# EAGLE design evpr_programmer (EAGLE 9.5.2)
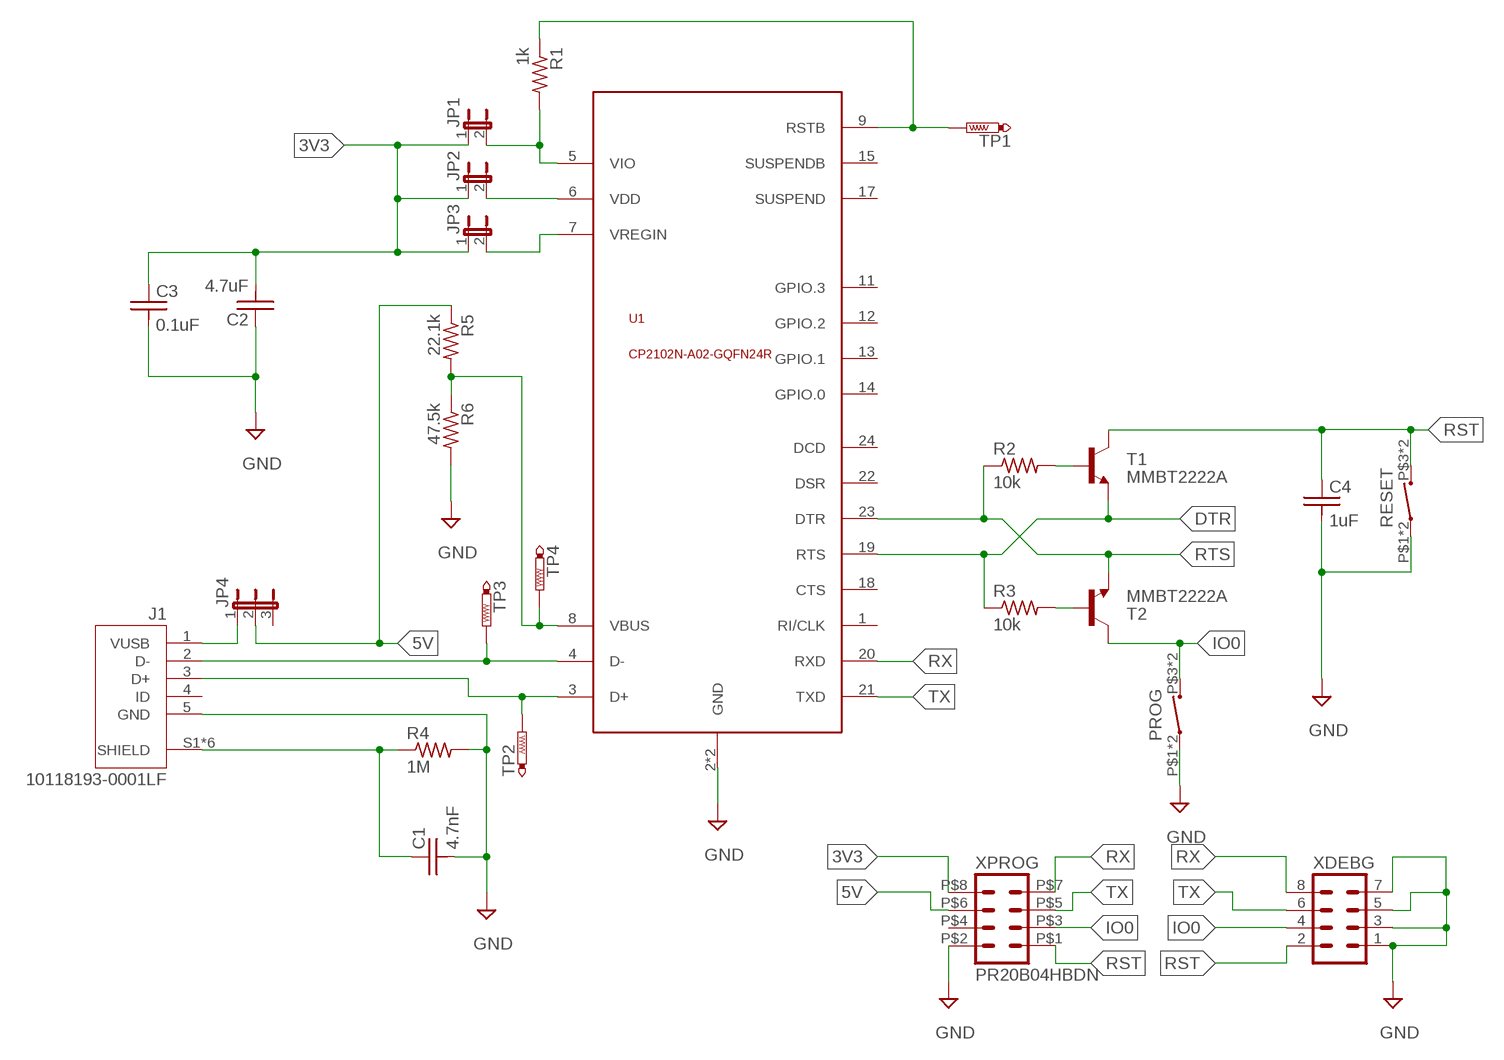
[diagram p0: schematic, sheet 1]

## Parts
C1  4.7nF  C0603  [C0603]
C2  4.7uF  C0603  [C0603]
C3  0.1uF  C0603  [C0603]
C4  1uF  C0603  [C0603]
J1  10118193-0001LF  [FCI_10118193-0001LF]
JP1  JP1E  [JP1]
JP2  JP1E  [JP1]
JP3  JP1E  [JP1]
JP4  JP2E  [JP2]
PROG  MOMENTARY_SWITCH  [PTS645]
R1  1k  R0603  [R0603]
R2  10k  R0603  [R0603]
R3  10k  R0603  [R0603]
R4  1M  R0603  [R0603]
R5  22.1k  R0603  [R0603]
R6  47.5k  R0603  [R0603]
RESET  MOMENTARY_SWITCH  [PTS645]
T1  MMBT2222A  MMBT2222ALT1-NPN-SOT23-BEC  [SOT23-BEC]
T2  MMBT2222A  MMBT2222ALT1-NPN-SOT23-BEC  [SOT23-BEC]
TP1  PTR1TP10R  [TP10R]
TP2  PTR1TP10R  [TP10R]
TP3  PTR1TP10R  [TP10R]
TP4  PTR1TP10R  [TP10R]
U1  CP2102N-A02-GQFN24R  [QFN24-4X4]
XDEBG  MA04-2  [MA04-2]
XPROG  PR20B04HBDN  [PR20B04HBDN]

## Nets
3V3: C2.2 C3.1 JP1.1 JP2.1 JP3.1 XPROG.P$8
5V: JP4.2 R5.1 XPROG.P$6
DTR: R3.1 T1.E U1.19(RTS)
GND: C1.2 C2.1 C3.2 C4.2 J1.5(GND) PROG.P$1 PROG.P$2 R4.2 R6.2 RESET.P$1 RESET.P$2 U1.2(GND) U1.EXP(GND) XDEBG.1 XDEBG.3 XDEBG.5 XDEBG.7 XPROG.P$2
IO0: PROG.P$3 PROG.P$4 T2.C XDEBG.4 XPROG.P$3
N$1: J1.1(VUSB) JP4.1
N$2: JP2.2 U1.6(VDD)
N$3: R1.1 TP1.TP U1.9(RSTB)
N$4: JP1.2 R1.2 U1.5(VIO)
N$5: C1.1 J1.S1(SHIELD) J1.S2(SHIELD) J1.S3(SHIELD) J1.S4(SHIELD) J1.S5(SHIELD) J1.S6(SHIELD) R4.1
N$7: R3.2 T2.B
N$8: R2.2 T1.B
N$11: J1.3(D+) TP2.TP U1.3(D+)
N$12: J1.2(D-) TP3.TP U1.4(D-)
N$13: JP3.2 U1.7(VREGIN)
N$14: R5.2 R6.1 TP4.TP U1.8(VBUS)
RST: C4.1 RESET.P$3 RESET.P$4 T1.C XDEBG.2 XPROG.P$1
RTS: R2.1 T2.E U1.23(DTR)
RX: U1.20(RXD) XDEBG.8 XPROG.P$7
TX: U1.21(TXD) XDEBG.6 XPROG.P$5
Unconnected: J1.4(ID) JP4.3 U1.1(RI/CLK) U1.11(GPIO.3) U1.12(GPIO.2) U1.13(GPIO.1) U1.14(GPIO.0) U1.15(SUSPENDB) U1.17(SUSPEND) U1.18(CTS) U1.22(DSR) U1.24(DCD) XPROG.P$4

## Library data of the parts
C1 = mccloud:C0603: CAPACITOR, American symbol; COMPONENT: CC0603CRNPO9BN4R7
C2 = mccloud:C0603: CAPACITOR, American symbol; COMPONENT: CL10A475MQ8NNNC
C3 = mccloud:C0603: CAPACITOR, American symbol; COMPONENT: 06033C104JAT2A
C4 = mccloud:C0603: CAPACITOR, American symbol
J1 = mccloud:10118193-0001LF: Micro USB B Type Receptacle; DESCRIPTION: Single Port 5 Contact Shielded SMT MICRO USB B-Type Receptacle; DIGI-KEY_PART_NUMBER: 609-4616-1-ND; DIGI-KEY_PURCHASE_URL: https://www.digikey.com/product-detail/en/amphenol-icc-fci/10118193-0001LF/609-4616-1-ND/2785380?utm_source=snapeda&utm_medium=aggregator&utm_campaign=symbol; MF: Amphenol ICC; MP: 10118193-0001LF; PACKAGE: None
JP1-JP3 = jumper:JP1E: JUMPER
JP4 = jumper:JP2E: JUMPER
PROG = mccloud:MOMENTARY_SWITCH
R1 = mccloud:R0603: RESISTOR, American symbol; COMPONENT: RMCF0603FT1K00; SPICEPREFIX: R
R2 R3 = mccloud:R0603: RESISTOR, American symbol; COMPONENT: RMCF0603FT10K0; SPICEPREFIX: R
R4 = mccloud:R0603: RESISTOR, American symbol; SPICEPREFIX: R
R5 = mccloud:R0603: RESISTOR, American symbol; COMPONENT: RMCF0603FT22K1; SPICEPREFIX: R
R6 = mccloud:R0603: RESISTOR, American symbol; COMPONENT: RMCF0603FT47K5; SPICEPREFIX: R
RESET = mccloud:MOMENTARY_SWITCH; COMPONENT: PTS645
T1 T2 = transistor-neu-to92:*-NPN-: NPN Transistror
TP1-TP4 = testpad:PTR1: TEST PIN
U1 = mccloud:CP2102N-A02-GQFN24R
XDEBG = con-lstb:MA04-2: PIN HEADER; OC_FARNELL: unknown; OC_NEWARK: unknown
XPROG = mccloud:PR20B04HBDN

## Board
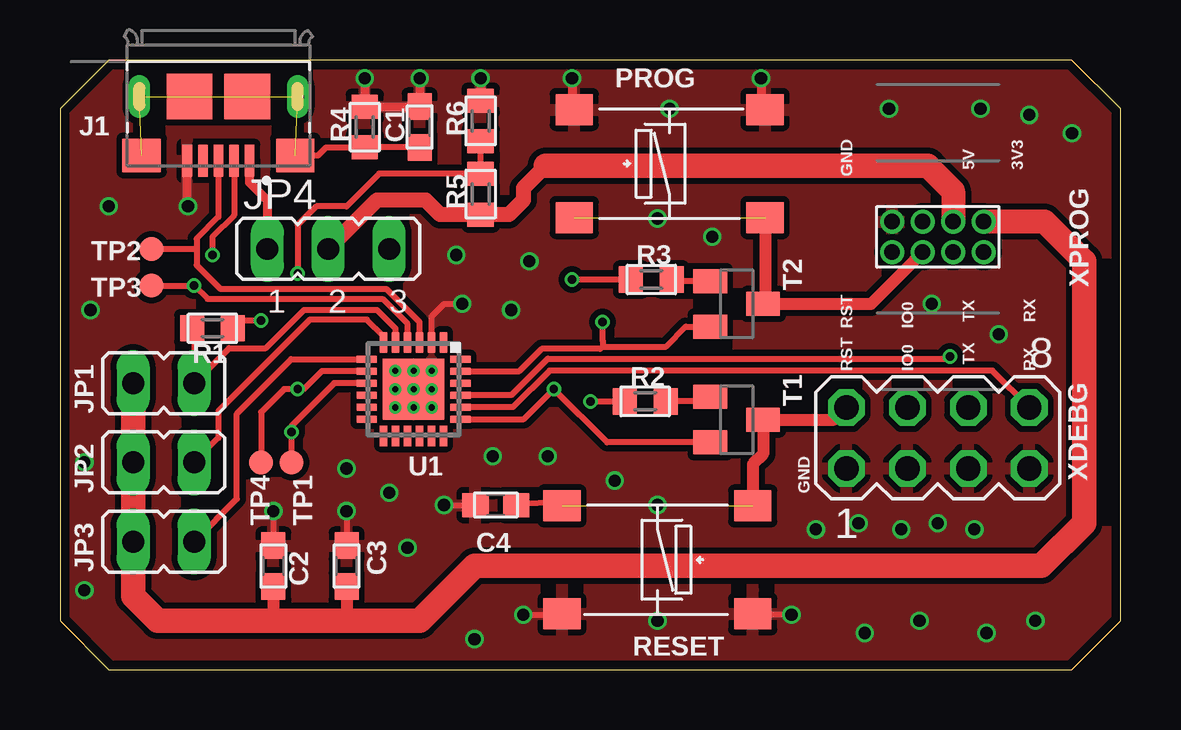
[diagram p1: board, top side]
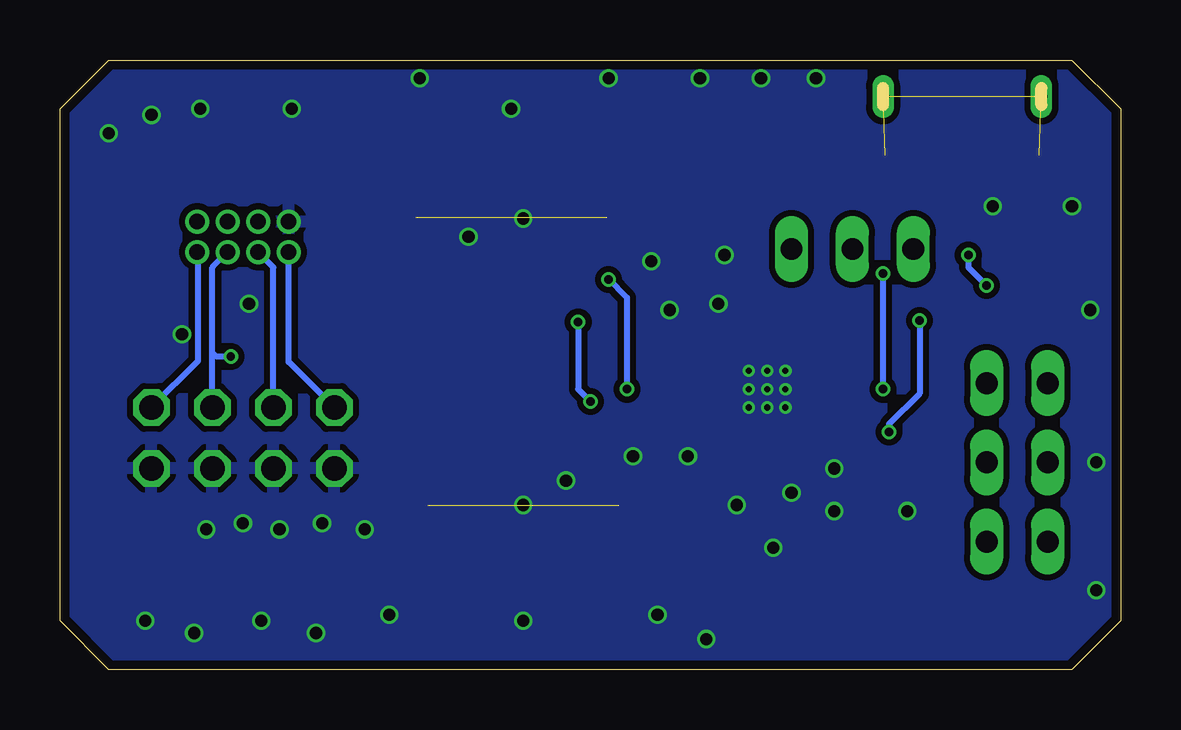
[diagram p2: board, bottom side, seen from below]

Size 44.2 x 25.4 mm. Coordinates in mm from the lower left corner, seen from the top.
Outline: 2.03,0 42.16,0 44.2,2.03 44.2,23.37 42.16,25.4 2.03,25.4 0,23.37 0,2.03 2.03,0
Copper layers (1*16): Top 0.035559375mm / dielectric 1.6mm / Bottom 0.035559375mm
Design rules "oshpark-2layer": minimum track width 6mil, minimum drill 10mil, track to track 6mil, track to pad 6mil, pad to pad 6mil, via to via 6mil, smd to smd 6mil, copper to edge 15mil, drill to drill 6mil, minimum pad ring 5mil, minimum via ring 5mil, stop-mask expansion 2.5mil, vias tented up to drill 0mil, thermal gap 10mil

### Footprints (pad centres in the part's own frame; a part is rotated, then mirrored left to right if it is on the bottom)
C0603 = smd 1.1 x 1: 1 -0.85,0; 2 0.85,0
FCI_10118193-0001LF = smd 0.4 x 1.35: 1 -1.3,2.675; 2 -0.65,2.675; 3 0,2.675; 4 0.65,2.675; 5 1.3,2.675 | smd 1.6 x 1.4: S1 -3.2,2.45; S2 3.2,2.45 | smd 1.9 x 1.9: S3 1.2,0; S4 -1.2,0 | drill 0.5 pad 0.9 long: S5 -3.3,0; S6 3.3,0
JP1 = drill 0.914 long: 1 0,-1.27; 2 0,1.27
JP2 = drill 0.914 long: 1 -2.54,0; 2 0,0; 3 2.54,0
PTS645 = smd 1.55 x 1.3: P$1 -3.975,2.25; P$2 3.975,2.25; P$3 -3.975,-2.25; P$4 3.975,-2.25
R0603 = smd 1 x 1.1: 1 -0.85,0; 2 0.85,0
SOT23-BEC = smd 1 x 1.4: B -0.95,-1.1; C 0,1.1; E 0.95,-1.1
TP10R = smd 1 x 1: TP 0,0
QFN24-4X4 = smd 0.85 x 0.3: 1 -1.95,1.25; 2 -1.95,0.75; 3 -1.95,0.25; 4 -1.95,-0.25; 5 -1.95,-0.75; 6 -1.95,-1.25; 13 1.95,-1.25; 14 1.95,-0.75; 15 1.95,-0.25; 16 1.95,0.25; 17 1.95,0.75; 18 1.95,1.25 | smd 0.3 x 0.85: 7 -1.25,-1.95; 8 -0.75,-1.95; 9 -0.25,-1.95; 10 0.25,-1.95; 11 0.75,-1.95; 12 1.25,-1.95; 19 1.25,1.95; 20 0.75,1.95; 21 0.25,1.95; 22 -0.25,1.95; 23 -0.75,1.95; 24 -1.25,1.95 | smd 2.55 x 2.55: EXP 0,0
MA04-2 = drill 1.016 octagon: 1 -3.81,-1.27; 2 -3.81,1.27; 3 -1.27,-1.27; 4 -1.27,1.27; 5 1.27,-1.27; 6 1.27,1.27; 7 3.81,-1.27; 8 3.81,1.27
PR20B04HBDN = drill 0.65 pad 1: P$1 -1.905,-0.635; P$2 -1.905,0.635; P$3 -0.635,-0.635; P$4 -0.635,0.635; P$5 0.635,-0.635; P$6 0.635,0.635; P$7 1.905,-0.635; P$8 1.905,0.635

### Placement (x,y rotation side)
C1  14.99,22.61 90 top
C2  8.89,4.32 270 top
C3  11.94,4.32 90 top
C4  18.16,6.86 180 top
J1  6.6,23.88 180 top
JP1  4.32,11.94 270 top
JP2  4.32,8.64 270 top
JP3  4.32,5.33 270 top
JP4  11.18,17.53 0 top
PROG  25.4,21.08 0 top
R1  6.35,14.22 180 top
R2  24.38,11.18 0 top
R3  24.64,16.26 0 top
R4  12.7,22.61 90 top
R5  17.53,19.81 90 top
R6  17.53,22.86 90 top
RESET  24.89,4.57 180 top
T1  28.19,10.41 270 top
T2  28.19,15.24 270 top
TP1  9.65,8.64 0 top
TP2  3.81,17.53 0 top
TP3  3.81,16 0 top
TP4  8.38,8.64 0 top
U1  14.73,11.68 270 top
XDEBG  36.58,9.65 0 top
XPROG  36.58,18.03 0 top

### Tracks (layer width: path | path; a pad name or v marks a point on that pad's centre or on a via)
3V3
  Top 0.508: C2.2 8.89,2.29 9.14,2.03 | C3.1 11.94,2.03
  Top 0.991: 42.67,17.02 41.02,18.67 XPROG.P$8
  Top 1.016: 42.67,17.02 42.67,6.1 40.89,4.32 17.27,4.32 14.99,2.03 11.94,2.03 9.14,2.03 4.06,2.03 3.05,3.05 JP3.1 JP2.1 JP1.1
5V
  Top 0.635: 20.23,20.99 19.3,20.07 19.3,19.56 18.71,18.96 R5.1 15.84,18.96 15.24,19.56 13.21,19.56 JP4.2
  Top 0.991: 36.16,20.99 37.21,19.94 XPROG.P$6
  Top 1.016: 20.23,20.99 36.16,20.99
DTR  (via drill 0.35)
  Top 0.254: v21.34,16.26 R3.1 | U1.19 19.32,10.43 v20.57,11.68 22.79,9.46 T1.E
  Bottom 0.254: v20.57,11.68 20.57,15.49 v21.34,16.26
GND  (via drill 0.25, 0.51)
  Top 0.254: U1.2 15.48,14.72 16,15.24 v16.76,15.24 | v8.89,6.6 C2.1 | v11.94,6.6 C3.2 | v16,6.86 C4.2 | v19.3,2.29 20.88,2.29 RESET.P$2 | v30.48,2.29 28.9,2.29 RESET.P$1
  Top 0.381: v5.33,19.3 5.3,19.33 J1.5 | 14.73,23.46 R4.2 v12.7,24.64 | 14.73,23.46 C1.2 | v14.99,24.64 14.99,23.71 14.73,23.46 | v17.53,24.64 R6.2 | v21.34,24.64 21.34,23.42 PROG.P$1 | v29.21,24.64 29.21,23.5 PROG.P$2
  other vias: 14.73,11.68 14.73,12.45 13.97,12.45 13.97,11.68 13.97,10.92 14.73,10.92 15.49,10.92 15.49,11.68 15.49,12.45 16.51,17.27 18.8,14.99 19.56,17.02 24.89,18.8 27.18,18.03 34.54,23.37 38.35,23.37 42.16,22.35 40.39,23.11 25.4,23.37 2.03,19.3 1.27,14.99 1.02,8.64 1.02,3.3 17.27,1.27 14.48,5.08 13.72,7.37 24.89,6.86 24.89,2.03 23.11,7.87 20.32,8.89 18.03,8.89 11.94,8.38 33.53,1.52 35.81,2.03 38.61,1.52 40.64,2.03 36.58,6.1 38.1,5.84 33.27,6.1 35.05,5.84 31.5,5.84 39.12,13.97 36.32,15.24
  pour Top (isolate 0.254): -7.37,27.69 -7.37,3.05 0.51,-4.83 42.16,-4.83 50.55,3.56 50.55,27.43 49.02,28.96 -6.1,28.96
  pour Bottom (isolate 0.254): -7.37,27.69 -7.37,3.05 0.51,-4.83 42.16,-4.83 50.55,3.56 50.55,27.43 49.02,28.96 -6.1,28.96
IO0  (1 unrouted)
  Top 0.508: PROG.P$4 29.38,15.32 T2.C 33.79,15.24 35.58,17.02 35.58,17.03 XPROG.P$3
  Bottom 0.254: XDEBG.4 35.31,16.76 XPROG.P$3
N$1
  Top 0.381: JP4.1 8.64,19.56 7.9,20.29 J1.1
N$2
  Top 0.254: U1.6 13.48,13.89 12.79,14.58 10.41,14.58 6.6,10.77 6.6,9.65 JP2.2
N$3  (via drill 0.35)
  Top 0.254: R1.1 7.53,14.55 v8.38,14.55 | U1.9 11.43,11.93 9.65,10.16 v9.65,9.91 TP1.TP
  Bottom 0.254: v8.38,14.55 8.38,11.5 9.65,10.23 v9.65,9.91
N$4
  Top 0.254: R1.2 5.59,14.14 JP1.2 7.05,13.39 8.58,13.39 10.17,14.99 13.21,14.99 13.98,14.21 U1.5
N$5  (5 unrouted)
  Top 0.254: J1.S1 10.76,21.43 11.09,21.76 R4.1 C1.1
  Top 0.381: J1.S2 2.97,20.99
N$7
  Top 0.254: T2.B 25.55,16.19 R3.2
N$8
  Top 0.254: T1.B 26.91,11.18 R2.2
N$11
  Top 0.254: J1.3 6.6,18.86 5.69,17.95 5.69,17.53 | 5.69,17.53 5.69,16.85 6.69,15.85 13.61,15.85 14.98,14.48 U1.3 | TP2.TP 5.69,17.53
N$12  (via drill 0.35)
  Top 0.254: U1.4 14.48,14.41 13.45,15.44 6.15,15.44 v5.59,16 TP3.TP | J1.2 7.25,18.94 6.35,18.03 v6.35,17.27
  Bottom 0.254: v6.35,17.27 6.35,16.76 v5.59,16
N$13
  Top 0.254: JP3.2 7.37,7.11 7.37,10.67 9.63,12.93 U1.7
N$14  (via drill 0.35)
  Top 0.254: R6.1 R5.2 13.3,20.66 11.94,19.3 10.67,19.3 9.91,18.54 v9.91,16.51 | U1.8 10.91,12.43 10.16,11.68 v9.91,11.68 9.34,11.68 8.38,10.73 TP4.TP
  Bottom 0.254: v9.91,16.51 v9.91,11.68
RST  (1 unrouted)
  Top 0.254: C4.1 19.06,6.91 20.79,6.95 RESET.P$4
  Top 0.508: XDEBG.2 32.26,10.41 T1.C 29.29,8.97 28.87,8.55 RESET.P$3
  Bottom 0.254: XDEBG.2 34.67,12.83 XPROG.P$1
RTS  (via drill 0.35)
  Top 0.254: T2.E 26.08,14.29 25.25,13.46 22.61,13.46 | 22.61,13.46 22.61,13.72 v22.61,14.48 | v22.1,11.18 R2.1 | U1.23 19.14,12.43 20.07,13.36 22.51,13.36 22.61,13.46
  Bottom 0.254: v22.61,14.48 22.61,11.68 v22.1,11.18
RX
  Top 0.254: XDEBG.8 38.85,12.46 20.4,12.46 18.88,10.93 U1.20
  Bottom 0.254: XPROG.P$7 38.46,17.37 38.46,12.85 XDEBG.8
TX  (via drill 0.35)
  Top 0.254: U1.21 18.8,11.43 20.32,12.96 37,12.96 v37.08,13.04
  Bottom 0.254: XDEBG.6 37.85,13.21 | 37.85,13.21 37.85,16.76 XPROG.P$5 | v37.08,13.04 37.68,13.04 37.85,13.21

### Text on the board
tPlace: GND | 5V | 3V3 | RST | IO0 | TX | RX | RST | IO0 | TX | RX | GND